# Altium project Control Panel v3.PrjPcb
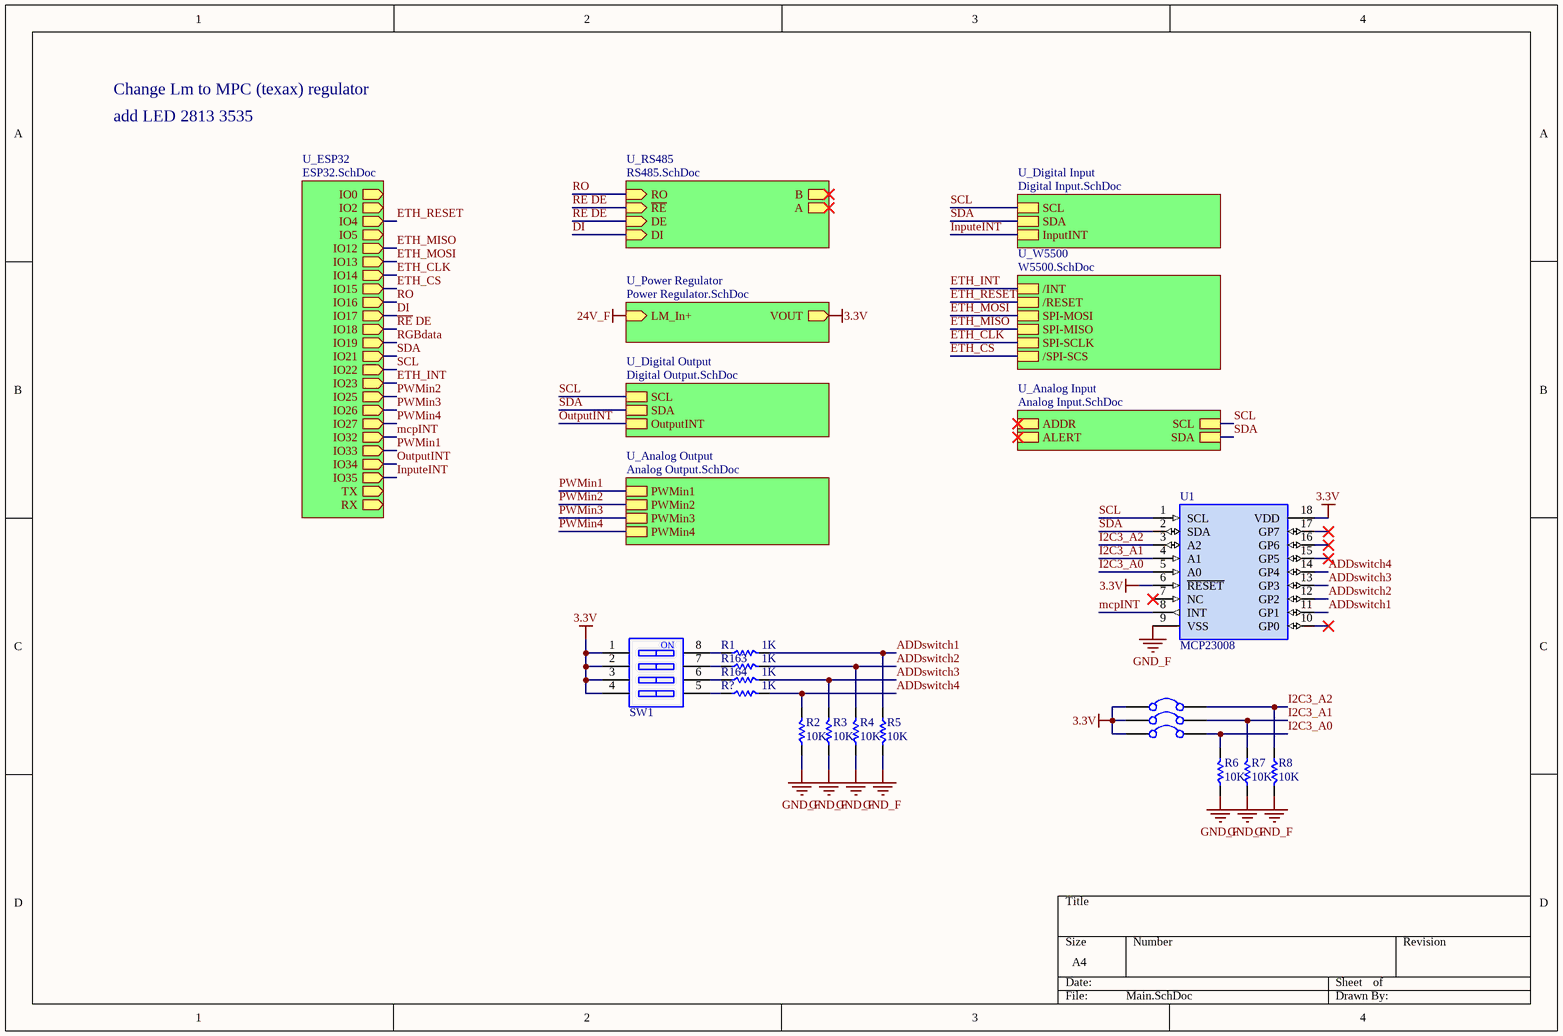
[diagram p0: Main.SchDoc]
6 sheets, 274 parts. Net scope: hierarchical (ports join the sheet entries above them; power ports are global).
Board file: Control Panel PCB v3.PcbDoc
Sheets:
  Main.SchDoc
    U_ESP32 = ESP32.SchDoc
    U_Power Regulator = Power Regulator.SchDoc
    U_Digital Output = Digital Output.SchDoc
    U_Digital Input = Digital Input.SchDoc
    U_W5500 = W5500.SchDoc

## Sheet Main.SchDoc
size A4; SheetNumber: 1; SheetTotal: 9

### Parts
R1  1K  [R 0805]
R2  10K  [R 0805]
R3  10K  [R 0805]
R4  10K  [R 0805]
R5  10K  [R 0805]
R6  10K  [R 0805]
R7  10K  [R 0805]
R8  10K  [R 0805]
R163  1K  [R 0805]
R164  1K  [R 0805]
R?  1K  [R 0805]
SB1  Solder Bridge  [Solder Bridge Open]  (value not drawn)
SB2  Solder Bridge  [Solder Bridge Open]  (value not drawn)
SB3  Solder Bridge  [Solder Bridge Open]  (value not drawn)
SW1  CSW-4P  [CSW DIP-4P_G]  (value not drawn)
U1  MCP23008  [SOP18W_M]

### Sub-sheets
U_Analog Input = Analog Input.SchDoc (file not in this document): ADDR, ALERT, SCL, SDA
U_Analog Output = Analog Output.SchDoc (file not in this document): PWMin1, PWMin2, PWMin3, PWMin4
U_Digital Input = Digital Input.SchDoc: SCL, SDA, InputINT
U_Digital Output = Digital Output.SchDoc: SCL, SDA, OutputINT
U_ESP32 = ESP32.SchDoc: IO2 (out), IO4 (out), IO5 (out), IO12 (out), IO13 (out), IO14 (out), IO15 (out), IO16 (out), IO17 (out), IO18 (out), IO19 (out), IO21 (out), IO22 (out), IO23 (out), IO25 (out), IO26 (out), IO27 (out), IO32 (out), IO33 (out), IO34 (out), IO35 (out), IO0 (out), TX (out), RX (out)
U_Power Regulator = Power Regulator.SchDoc: LM_In+ (in), VOUT (out)
U_RS485 = RS485.SchDoc (file not in this document): RO (in), ~{RE} (in), DE (in), DI (in), B (out), A (out)
U_W5500 = W5500.SchDoc: /INT, /RESET, SPI-MOSI, SPI-MISO, SPI-SCLK, /SPI-SCS

### Nets
3.3V: SB1.1 SB2.1 SB3.1 SW1.1 SW1.2 SW1.3 SW1.4 U1.6(~{RESET}) U1.18(VDD) ; sheet U_Power Regulator/VOUT
GND_F: R2.1 R3.1 R4.1 R5.2 R6.1 R7.1 R8.2 U1.9(VSS)
ADDswitch1: R1.2 R5.1 U1.11(GP1)
ADDswitch2: R4.2 R163.2 U1.12(GP2)
ADDswitch3: R3.2 R164.2 U1.13(GP3)
ADDswitch4: R2.2 R?.2 U1.14(GP4)
DI: sheet U_ESP32/IO17, sheet U_RS485/DI
ETH_CLK: sheet U_ESP32/IO14, sheet U_W5500/SPI-SCLK
ETH_CS: sheet U_ESP32/IO15, sheet U_W5500//SPI-SCS  [project net /SPI-SCS]
ETH_INT: sheet U_ESP32/IO23, sheet U_W5500//INT  [project net /INT]
ETH_MISO: sheet U_ESP32/IO12, sheet U_W5500/SPI-MISO
ETH_MOSI: sheet U_ESP32/IO13, sheet U_W5500/SPI-MOSI
ETH_RESET: sheet U_ESP32/IO4, sheet U_W5500//RESET  [project net /RESET]
I2C3_A0: R6.2 SB3.2 U1.5(A0)
I2C3_A1: R7.2 SB2.2 U1.4(A1)
I2C3_A2: R8.1 SB1.2 U1.3(A2)
InputeINT: sheet U_ESP32/IO35, sheet U_Digital Input/InputINT
mcpINT: U1.8(INT) ; sheet U_ESP32/IO32
OutputINT: sheet U_ESP32/IO34, sheet U_Digital Output/OutputINT
PWMin1: sheet U_ESP32/IO33, sheet U_Analog Output/PWMin1
PWMin2: sheet U_ESP32/IO25, sheet U_Analog Output/PWMin2
PWMin3: sheet U_ESP32/IO26, sheet U_Analog Output/PWMin3
PWMin4: sheet U_ESP32/IO27, sheet U_Analog Output/PWMin4
~{RE} DE: sheet U_ESP32/IO18, sheet U_RS485/~{RE}, sheet U_RS485/DE
RO: sheet U_ESP32/IO16, sheet U_RS485/RO
SCL: U1.1(SCL) ; sheet U_ESP32/IO22, sheet U_Digital Output/SCL, sheet U_Digital Input/SCL, sheet U_Analog Input/SCL
SDA: U1.2(SDA) ; sheet U_ESP32/IO21, sheet U_Digital Output/SDA, sheet U_Digital Input/SDA, sheet U_Analog Input/SDA
NetR1_1: R1.1 SW1.8
NetR163_1: R163.1 SW1.7
NetR164_1: R164.1 SW1.6
NetR?_1: R?.1 SW1.5

Not connected (* = marked no-connect by the designer): U1 7(NC)* 10(GP0)* 15(GP5)* 16(GP6)* 17(GP7)*

### Notes on the sheet
- Change Lm to MPC (texax) regulator
- add LED 2813 3535
- (in symbol CSW-4P) NO

### Library data of the parts
R1-R8 R163 R164 R? = R: Chip resistor; 版权归属: 源创客; BOM名称: Chip resistor; 学习资源: www.ooocke.com
SW1 = CSW-4P: 4-way code switch; BOM名称: 4路编码开关; 版权归属: 源创客; 学习资源: www.ooocke.com
U1 = MCP23008: 8 Bit I/O Expander

## Sheet ESP32.SchDoc
size A4; SheetNumber: 6; SheetTotal: 11
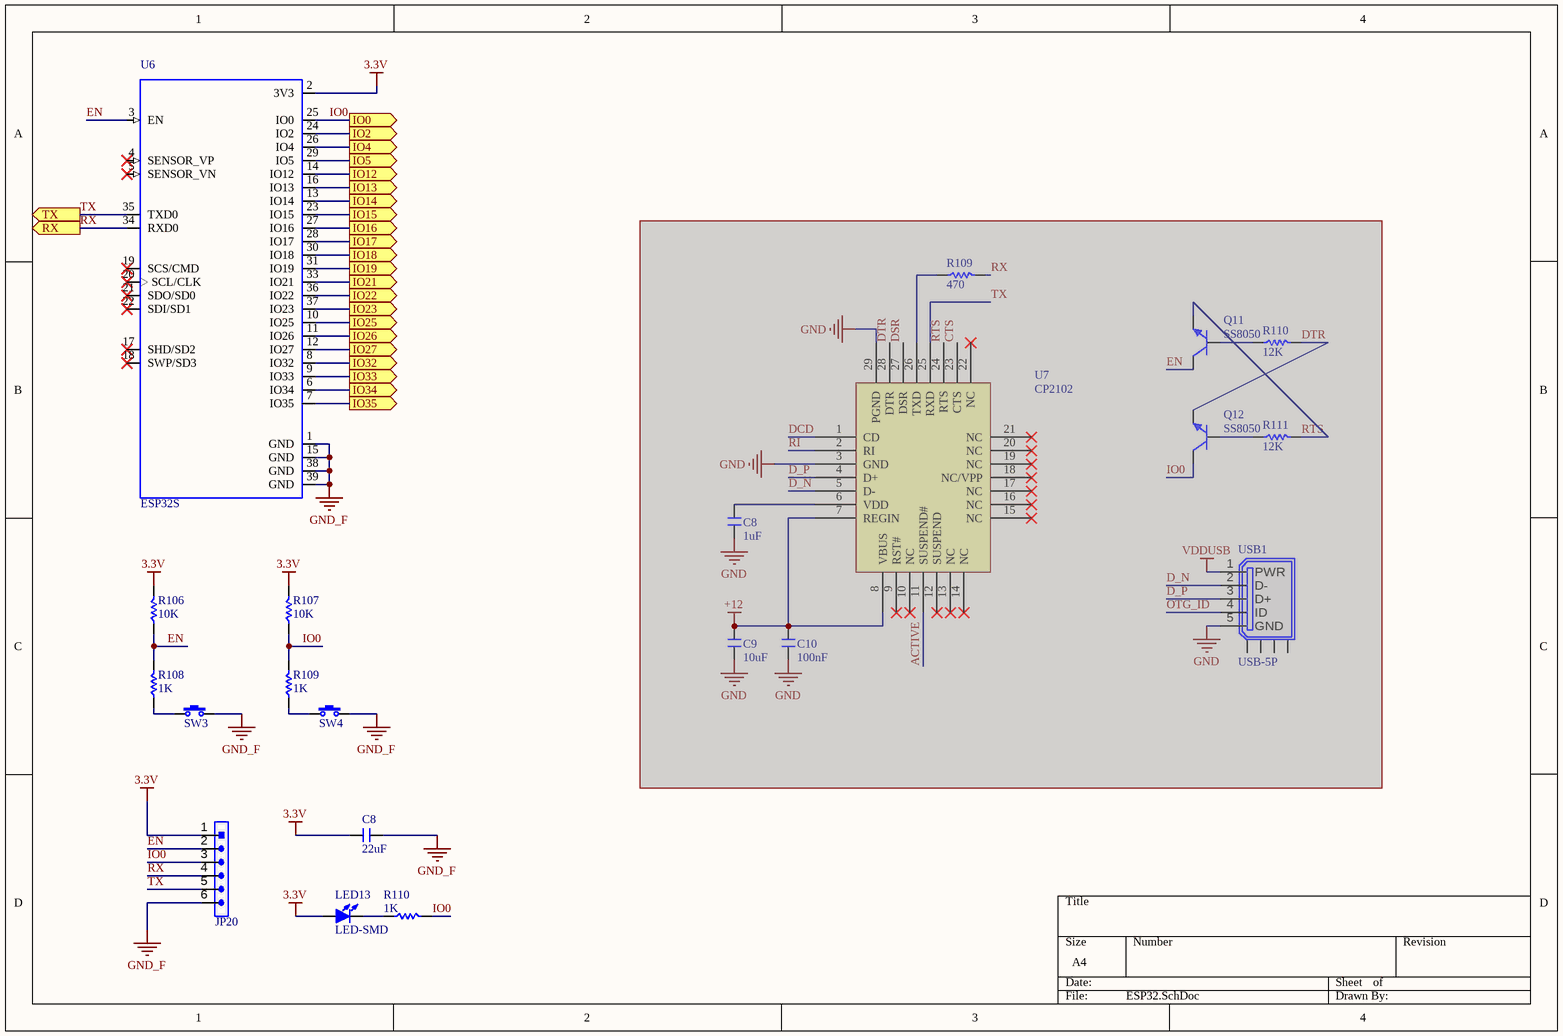
[diagram p1: ESP32.SchDoc]

### Parts
(Parts that share a designator on the sheet are numbered #1, #2 ... from top to bottom, then left to right.)
C8#1  1uF  [C 0805]  (masked out: inside a compile mask, not in the netlist)
C8#2  22uF  [C 0805]
C9#1  10uF  [C 0805]  (masked out: inside a compile mask, not in the netlist)
C10#1  100nF  [C 0805]  (masked out: inside a compile mask, not in the netlist)
JP20#1  HDR-1X6  [HDR-1X6]  (value not drawn)
LED13  LED-SMD  [LED 0805B]
Q11  SS8050  [SOT23-3N]  (masked out: inside a compile mask, not in the netlist)
Q12  SS8050  [SOT23-3N]  (masked out: inside a compile mask, not in the netlist)
R106  10K  [R 0805]
R107  10K  [R 0805]
R108  1K  [R 0805]
R109#1  470  [R 0805]  (masked out: inside a compile mask, not in the netlist)
R109#2  1K  [R 0805]
R110#1  12K  [R 0805]  (masked out: inside a compile mask, not in the netlist)
R110#2  1K  [R 0805]
R111#1  12K  [R 0805]  (masked out: inside a compile mask, not in the netlist)
SW3  3x6x5  [TSW SMD-3*6*2.5]  (value not drawn)
SW4  3x6x5  [TSW SMD-3*6*2.5]  (value not drawn)
U6  ESP32S  [ESP32S]
U7#1  CP2102  [QFN28]  (masked out: inside a compile mask, not in the netlist)
USB1  USB-5P  [USB-micro_B]  (masked out: inside a compile mask, not in the netlist)

### Ports
IO0 (out), IO2 (out), IO4 (out), IO5 (out), IO12 (out), IO13 (out), IO14 (out), IO15 (out), IO16 (out), IO17 (out), IO18 (out), IO19 (out), IO21 (out), IO22 (out), IO23 (out), IO25 (out), IO26 (out), IO27 (out), IO32 (out), IO33 (out), IO34 (out), IO35 (out), RX (out), TX (out)

### Nets
3.3V: C8#2.1 JP20#1.1 LED13.1(A) R106.2 R107.2 U6.2(3V3)
GND_F: C8#2.2 JP20#1.6 SW3.2 SW4.2 U6.1(GND) U6.15(GND) U6.38(GND) U6.39(GND)
/INT: U6.37(IO23) ; port IO23
/RESET: U6.26(IO4) ; port IO4
/SPI-SCS: U6.23(IO15) ; port IO15
DI: U6.28(IO17) ; port IO17
EN: JP20#1.2 R106.1 R108.2 U6.3(EN)
ETH_CLK: U6.13(IO14) ; port IO14
ETH_MISO: U6.14(IO12) ; port IO12
ETH_MOSI: U6.16(IO13) ; port IO13
InputeINT: U6.7(IO35) ; port IO35
IO0: JP20#1.3 R107.1 R109#2.2 R110#2.2 U6.25(IO0) ; port IO0
mcpINT: U6.8(IO32) ; port IO32
OutputINT: U6.6(IO34) ; port IO34
PWMin1: U6.9(IO33) ; port IO33
PWMin2: U6.10(IO25) ; port IO25
PWMin3: U6.11(IO26) ; port IO26
PWMin4: U6.12(IO27) ; port IO27
~{RE} DE: U6.30(IO18) ; port IO18
RGBdata: U6.31(IO19) ; port IO19
RO: U6.27(IO16) ; port IO16
RX: JP20#1.4 U6.34(RXD0) ; port RX
SCL: U6.36(IO22) ; port IO22
SDA: U6.33(IO21) ; port IO21
TX: JP20#1.5 U6.35(TXD0) ; port TX
NetLED13_2: LED13.2(K) R110#2.1
NetR108_1: R108.1 SW3.1
NetR109#2_1: R109#2.1 SW4.1
NetU6_24: U6.24(IO2) ; port IO2
NetU6_29: U6.29(IO5) ; port IO5

Not connected (* = marked no-connect by the designer): U6 4(SENSOR_VP)* 5(SENSOR_VN)* 17(SHD/SD2)* 18(SWP/SD3)* 19(SCS/CMD)* 20(SCL/CLK)* 21(SDO/SD0)* 22(SDI/SD1)*

### Library data of the parts
C8#1 C8#2 C9#1 C10#1 = C: Non-polar patch capacitor; BOM名称: 无极性贴片电容; 版权归属: 源创客; 学习资源: www.ooocke.com
JP20#1 = Header 6: 6P Connector; BOM名称: 6P接插件; 版权归属: 源创客; 学习资源: www.ooocke.com
LED13 = LED-SMD: Patch LED; BOM名称: 贴片LED; 版权归属: 源创客; 学习资源: www.ooocke.com
Q11 Q12 = 8050-SMD: High frequency amplification-NPN; BOM名称: 高频放大-NPN型; 版权归属: 源创客; 属性: 40V 1.5A 1W 100MHZ; 学习资源: www.ooocke.com
R106-R108 R109#1 R109#2 R110#1 R110#2 R111#1 = R: Chip resistor; 版权归属: 源创客; BOM名称: Chip resistor; 学习资源: www.ooocke.com
SW3 SW4 = TSW 3x6: 3x6 tact switch; BOM名称: 3x6轻触开关; 版权归属: 源创客; 学习资源: www.ooocke.com
U6 = ESP32S: MP: ESP32-WROOM-32D; MF: Espressif Systems; Package: Module Espressif Systems; Price: None; Availability: Unavailable; SnapEDA_Link: https://www.snapeda.com/parts/ESP32-WROOM-32D/Espressif%20Systems/view-part/?ref=snap; Value: *
U7#1 = CP2102: USB to USRT converter
USB1 = USB-5P: Micro & Mini USB female; BOM名称: 微型USB母座; 版权归属: 源创客; 学习资源: www.ooocke.com

## Sheet Power Regulator.SchDoc
size A4; SheetNumber: 2; SheetTotal: 9
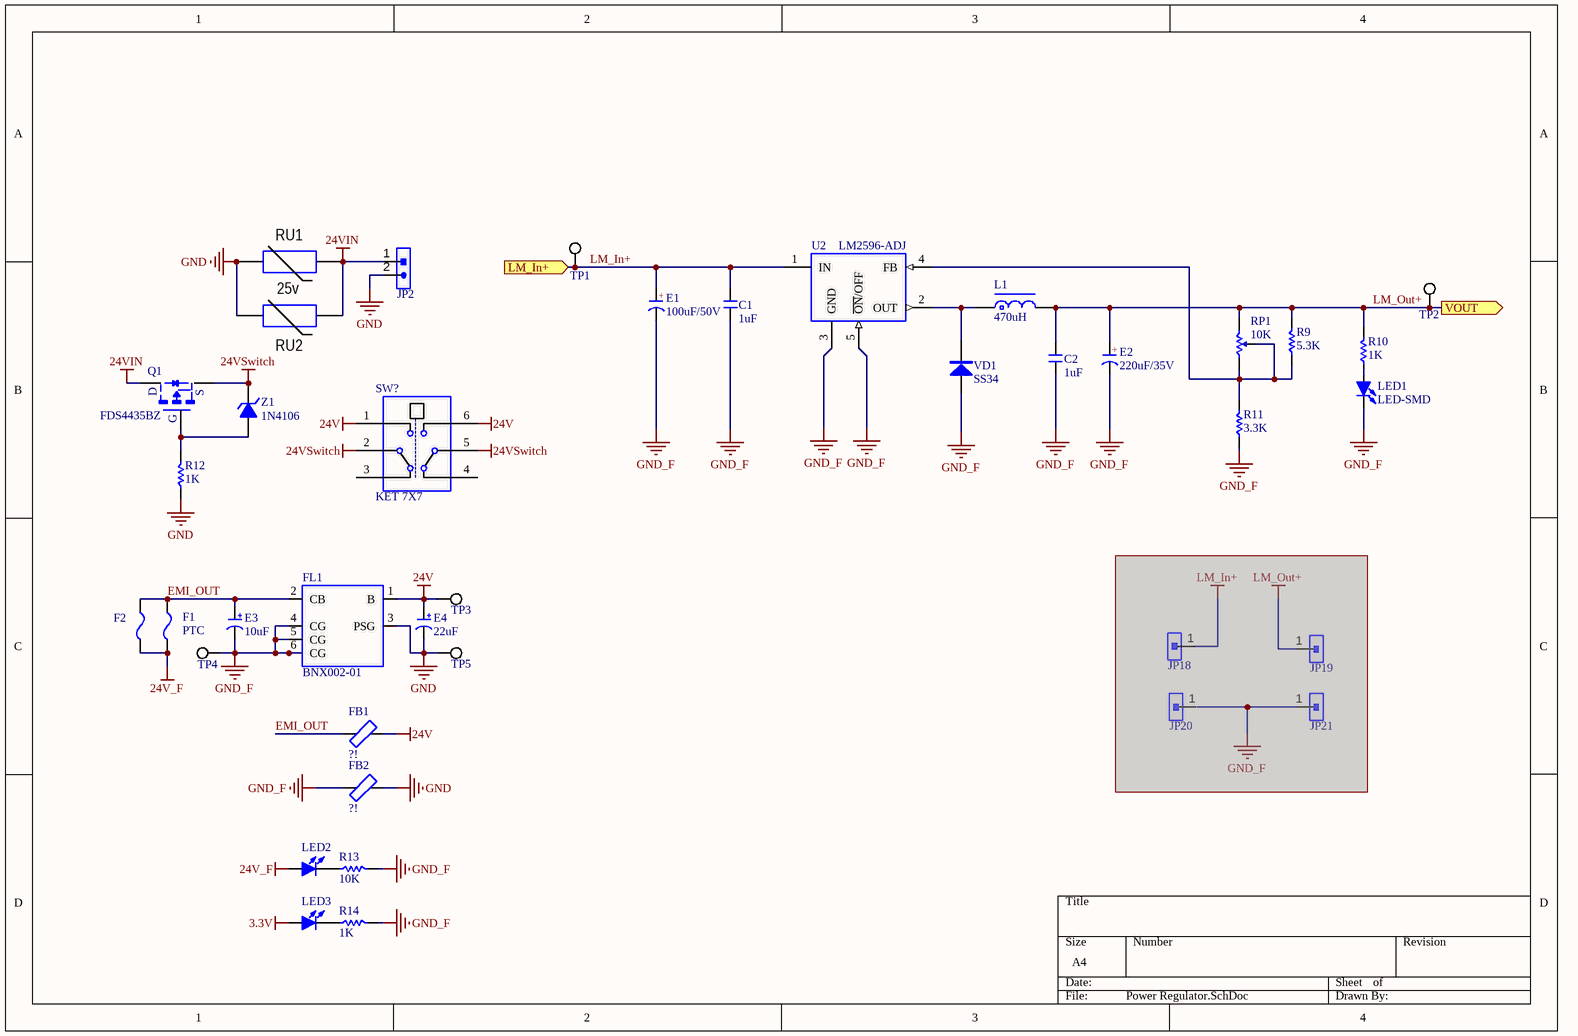
[diagram p2: Power Regulator.SchDoc]

### Parts
(Parts that share a designator on the sheet are numbered #1, #2 ... from top to bottom, then left to right.)
C1  1uF  [C 0805]
C2  1uF  [C 0805]
E1  100uF/50V  [CM E(8*10.2)]
E2  220uF/35V  [CM E(8*10.2)]
E3  10uF  [CM D(6.3*7.7)]
E4  22uF  [CM D(6.3*7.7)]
F1  PTC  [PTC]
F2  MSMD200-8V 2A  [FU 1206]  (value not drawn)
FB1  ?!  [F 1206]
FB2  ?!  [F 1206]
FL1  BNX002-01  [FIL_BNX002-01]
JP2  HDR-1X2  [KF2EDGK-2P_H_7.62]  (value not drawn)
JP18#1  HDR-1X1  [HDR-1X1]  (value not drawn)  (masked out: inside a compile mask, not in the netlist)
JP19  HDR-1X1  [HDR-1X1]  (value not drawn)  (masked out: inside a compile mask, not in the netlist)
JP20#2  HDR-1X1  [HDR-1X1]  (value not drawn)  (masked out: inside a compile mask, not in the netlist)
JP21  HDR-1X1  [HDR-1X1]  (value not drawn)  (masked out: inside a compile mask, not in the netlist)
L1  470uH  [CDRH127]
LED1  LED-SMD  [LED 0805R]
LED2  LED-SMD  [LED 0805R]  (value not drawn)
LED3  LED-SMD  [LED 0805R]  (value not drawn)
Q1  FDS4435BZ  [SOP8-E3]
R9  5.3K  [R 0805]
R10  1K  [R 0805]
R11  3.3K  [R 0805]
R12  1K  [R 0805]
R13  10K  [R 0805]
R14  1K  [R 0805]
RP1  10K  [3296W]
RU1  25v  [SMA]
RU2  *  [Varistor Short Hieght - Straight]  (value not drawn)
SW?  KET 7X7  [KFT DIP-7X7]
TP1  Test Point Pad  [TP15]  (value not drawn)
TP2  Test Point Pad  [TP15]  (value not drawn)
TP3  Test Point Pad  [TP15]  (value not drawn)
TP4  Test Point Pad  [TP15]  (value not drawn)
TP5  Test Point Pad  [TP15]  (value not drawn)
U2  LM2596-ADJ  [TO263-5A]
VD1  SS34  [SMA]
Z1  1N4106  [DO-213AA]

### Ports
LM_In+ (in), VOUT (out)

### Nets
3.3V: C2.2 E2.1(A) L1.2 LED3.1(A) R9.2 R10.2 RP1.2 TP2.1 ; port VOUT  [also labelled LM_Out+]
24V: E4.1(A) FB1.2 FL1.1(B) SW?.1 SW?.6 TP3.1
24VIN: JP2.1 Q1.5-8(D) RU1.2 RU2.2
24VSwitch: Q1.1-3(S) SW?.2 SW?.5 Z1.2(K)
GND: E4.2(K) FB2.2 FL1.3(PSG) JP2.2 R12.1 RU1.1 RU2.1 TP5.1
GND_F: C1.1 C2.1 E1.2(K) E2.2(K) E3.2(K) FB2.1 FL1.4(CG) FL1.5(CG) FL1.6(CG) LED1.2(K) R11.1 R13.2 R14.2 TP4.1 U2.3(GND) U2.5(~{ON}/OFF) VD1.1(A)
LM_In+: C1.2 E1.1(A) F1.1 F2.1 LED2.1(A) TP1.1 U2.1(IN) ; port LM_In+  [also labelled 24V_F]
EMI_OUT: E3.1(A) F1.2 F2.2 FB1.1 FL1.2(CB)
NetL1_1: L1.1 U2.2(OUT) VD1.2(K)
NetLED1_1: LED1.1(A) R10.1
NetLED2_2: LED2.2(K) R13.1
NetLED3_2: LED3.2(K) R14.1
NetQ1_4: Q1.4(G) R12.2 Z1.1(A)
NetR9_1: R9.1 R11.2 RP1.1 RP1.ADJ U2.4(FB)

Not connected (* = marked no-connect by the designer): SW? 3 4

### Notes on the sheet
- (in symbol C-CM) +
- (in symbol KET 7X7) ---------------

### Library data of the parts
C1 C2 = C: as C8#1 on sheet ESP32; 学习资源: www.ooocke.com
E1-E4 = C-CM: Chip electrolytic capacitor; BOM名称: 贴片电解电容; 版权归属: 源创客; 学习资源: www.ooocke.com
F2 = FU: Chip fuse; BOM名称: 贴片保险丝; 版权归属: 源创客; 学习资源: www.ooocke.com
FB1 FB2 = FB: Ferrite Bead; BOM名称: 贴片电阻; 版权归属: 源创客; 学习资源: www.ooocke.com
FL1 = BNX002-01: LC EMI Filter 5th Order Low Pass 2 Channel 10A Block, 4 Lead; MF: Murata; Package: Block-4 Murata; Price: None; SnapEDA_Link: https://www.snapeda.com/parts/BNX002-01/Murata%20Electronics%20North%20America/view-part/12269/?ref=snap; Availability: Unavailable; Value: *; MP: BNX002-01
JP2 = Header 2: 2P Connector; BOM名称: 2P接插件; 版权归属: 源创客; 学习资源: www.ooocke.com
JP18#1 JP19 JP20#2 JP21 = Header 1: 1P Connector; BOM名称: 1P接插件; 版权归属: 源创客; 学习资源: www.ooocke.com
L1 = L-CDRH: Power shielded inductor; BOM名称: 功率屏蔽电感; 版权归属: 源创客; 学习资源: www.ooocke.com
LED1-LED3 = LED-SMD: Patch LED; BOM名称: 贴片LED; 版权归属: 源创客; 学习资源: www.ooocke.com
R9-R14 = R: Chip resistor; 版权归属: 源创客; BOM名称: Chip resistor; 学习资源: www.ooocke.com
RP1 = RP-THD: Plug-in potentiometer; BOM名称: 插件电位器; 版权归属: 源创客; 学习资源: www.ooocke.com
RU1 RU2 = V: Versiror; Manufacturer: *; Model: *; HelpURL: *; ComponentKind: *; Value: *
SW? = KET 7X7: 7*7 switch; BOM名称: 7*7开关; 版权归属: 源创客; 学习资源: www.ooocke.com
TP1-TP5 = Test Point Pad: Company: SJ Libraries; Designer: Eng. Saeid Jorablo; Rule: UNIONINDEX=0|RULEKIND=ComponentClearance|NETSCOPE=AnyNet|LAYERKIND=SameLayer|NAME=Schematic Component Clearance Constraint|GAP=0mil|COLLISIONCHECKMODE=3|VERTICALGAP=0mil|SHOWDISTANCES=FALSE|UNIT=Imperial; Mounting Technology: Surface Mount\Through-Hole; ComponentLink1Description: Datasheet; Pin Count: 0; Update Date: 6/3/2012; Category: MISC; HelpURL: http://s3.picofile.com/file/7443264187/Coming_Soon_logo.gif
U2 = LM2596: DC step-down chip; BOM名称: DC稳压芯片; 版权归属: 源创客; 学习资源: www.ooocke.com
VD1 = SS34: Schottky diodes; BOM名称: 肖特基二极管; 版权归属: 源创客; 属性: 40V/3A; 学习资源: www.ooocke.com
Z1 = 1N4106: 12V/0.5W voltage regulator; BOM名称: 12V/0.5W稳压管; 版权归属: 源创客; 学习资源: www.ooocke.com

## Sheet Digital Output.SchDoc
size A4; SheetNumber: 4; SheetTotal: 11
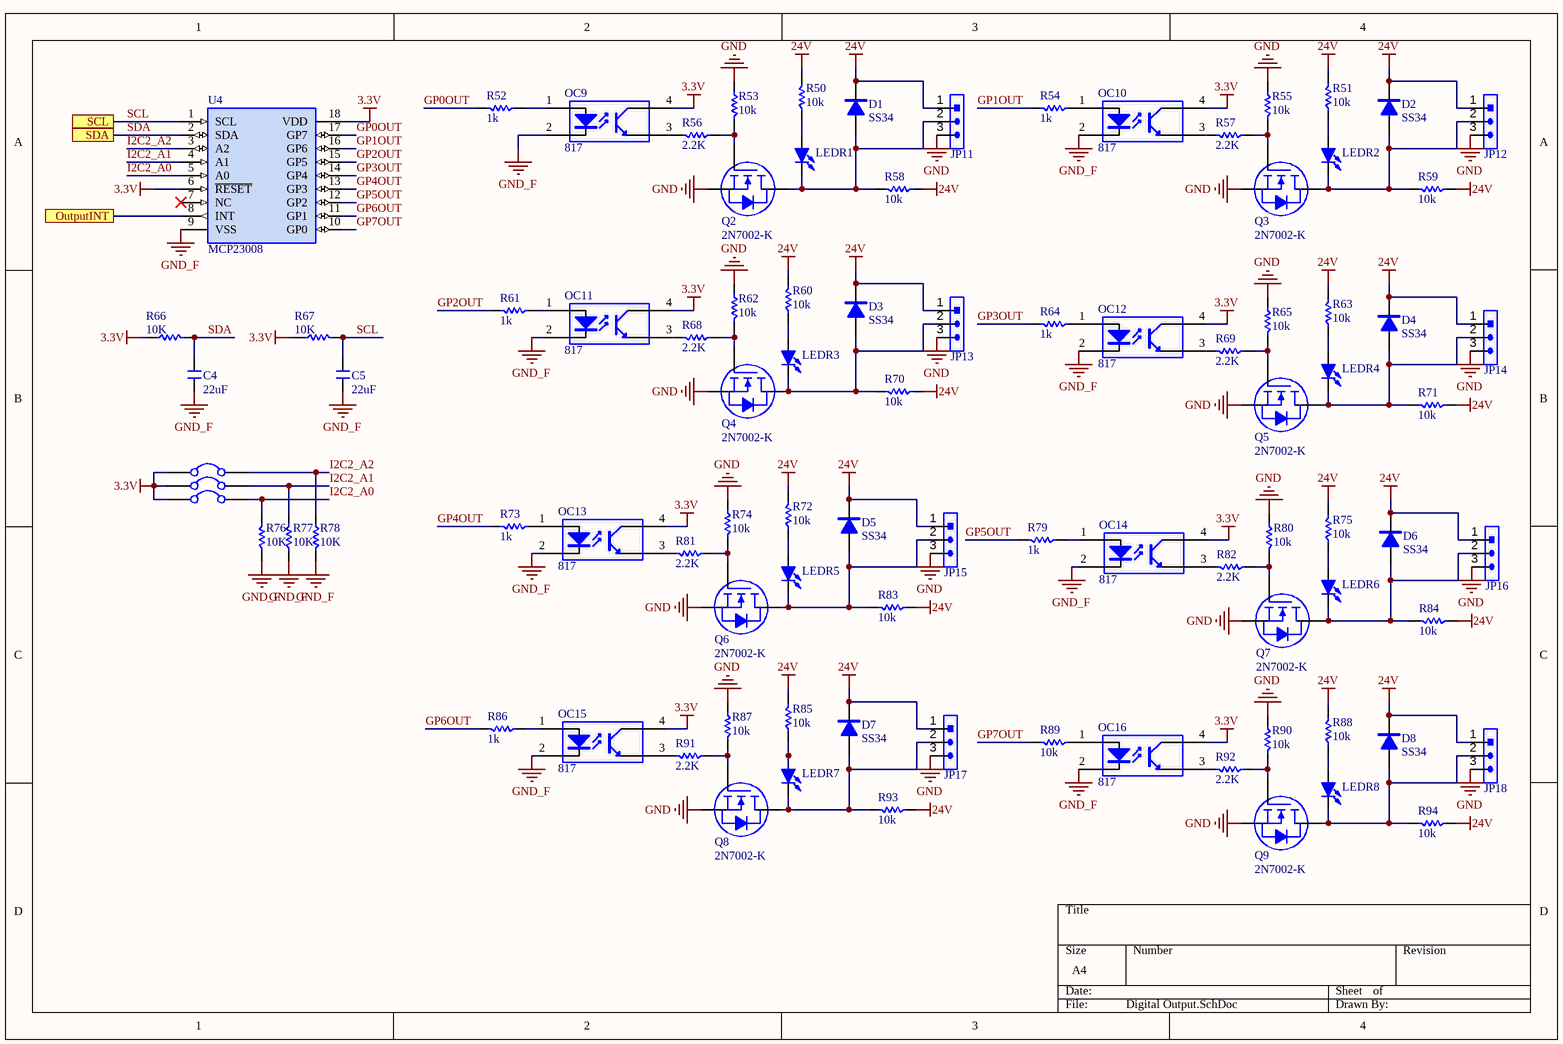
[diagram p3: Digital Output.SchDoc]

### Parts
(Parts that share a designator on the sheet are numbered #1, #2 ... from top to bottom, then left to right.)
C4#1  22uF  [C 0805]
C5  22uF  [C 0805]
D1  SS34  [SMA]
D2  SS34  [SMA]
D3  SS34  [SMA]
D4  SS34  [SMA]
D5  SS34  [SMA]
D6  SS34  [SMA]
D7  SS34  [SMA]
D8  SS34  [SMA]
JP11  HDR-1X3  [KF301-3P]  (value not drawn)
JP12  HDR-1X3  [KF301-3P]  (value not drawn)
JP13  HDR-1X3  [KF301-3P]  (value not drawn)
JP14  HDR-1X3  [KF301-3P]  (value not drawn)
JP15  HDR-1X3  [KF301-3P]  (value not drawn)
JP16  HDR-1X3  [KF301-3P]  (value not drawn)
JP17  HDR-1X3  [KF301-3P]  (value not drawn)
JP18#2  HDR-1X3  [KF301-3P]  (value not drawn)
LEDR1  LED-SMD  [LED 0805B]  (value not drawn)
LEDR2  LED-SMD  [LED 0805B]  (value not drawn)
LEDR3  LED-SMD  [LED 0805B]  (value not drawn)
LEDR4  LED-SMD  [LED 0805B]  (value not drawn)
LEDR5  LED-SMD  [LED 0805B]  (value not drawn)
LEDR6  LED-SMD  [LED 0805B]  (value not drawn)
LEDR7  LED-SMD  [LED 0805B]  (value not drawn)
LEDR8  LED-SMD  [LED 0805B]  (value not drawn)
OC9  817  [PC817-SMD]
OC10  817  [PC817-SMD]
OC11  817  [PC817-SMD]
OC12  817  [PC817-SMD]
OC13  817  [PC817-SMD]
OC14  817  [PC817-SMD]
OC15  817  [PC817-SMD]
OC16  817  [PC817-SMD]
Q2  2N7002-K  [SOT23-3L]
Q3  2N7002-K  [SOT23-3L]
Q4  2N7002-K  [SOT23-3L]
Q5  2N7002-K  [SOT23-3L]
Q6  2N7002-K  [SOT23-3L]
Q7  2N7002-K  [SOT23-3L]
Q8  2N7002-K  [SOT23-3L]
Q9  2N7002-K  [SOT23-3L]
R50  10k  [R 0805]
R51  10k  [R 0805]
R52  1k  [R 0805]
R53  10k  [R 0805]
R54  1k  [R 0805]
R55  10k  [R 0805]
R56  2.2K  [R 0805]
R57  2.2K  [R 0805]
R58  10k  [R 0805]
R59  10k  [R 0805]
R60  10k  [R 0805]
R61  1k  [R 0805]
R62  10k  [R 0805]
R63  10k  [R 0805]
R64  1k  [R 0805]
R65  10k  [R 0805]
R66  10K  [R 0805]
R67  10K  [R 0805]
R68  2.2K  [R 0805]
R69  2.2K  [R 0805]
R70  10k  [R 0805]
R71  10k  [R 0805]
R72  10k  [R 0805]
R73  1k  [R 0805]
R74  10k  [R 0805]
R75  10k  [R 0805]
R76  10K  [R 0805]
R77  10K  [R 0805]
R78  10K  [R 0805]
R79  1k  [R 0805]
R80  10k  [R 0805]
R81  2.2K  [R 0805]
R82  2.2K  [R 0805]
R83  10k  [R 0805]
R84  10k  [R 0805]
R85  10k  [R 0805]
R86  1k  [R 0805]
R87  10k  [R 0805]
R88  10k  [R 0805]
R89  10k  [R 0805]
R90  10k  [R 0805]
R91  2.2K  [R 0805]
R92  2.2K  [R 0805]
R93  10k  [R 0805]
R94  10k  [R 0805]
SB7  Solder Bridge  [Solder Bridge Open]  (value not drawn)
SB8  Solder Bridge  [Solder Bridge Open]  (value not drawn)
SB9  Solder Bridge  [Solder Bridge Open]  (value not drawn)
U4  MCP23008  [SOP18W_M]

### Ports
OutputINT, SCL, SDA

### Nets
3.3V: OC9.4(C) OC10.4(C) OC11.4(C) OC12.4(C) OC13.4(C) OC14.4(C) OC15.4(C) OC16.4(C) R66.1 R67.1 SB7.1 SB8.1 SB9.1 U4.6(~{RESET}) U4.18(VDD)
24V: D1.2(K) D2.2(K) D3.2(K) D4.2(K) D5.2(K) D6.2(K) D7.2(K) D8.2(K) JP11.1 JP12.1 JP13.1 JP14.1 JP15.1 JP16.1 JP17.1 JP18#2.1 R50.2 R51.2 R58.1 R59.1 R60.2 R63.2 R70.1 R71.1 R72.2 R75.2 R83.1 R84.1 R85.2 R88.2 R93.1 R94.1
GND: JP11.3 JP12.3 JP13.3 JP14.3 JP15.3 JP16.3 JP17.3 JP18#2.3 Q2.2(S) Q3.2(S) Q4.2(S) Q5.2(S) Q6.2(S) Q7.2(S) Q8.2(S) Q9.2(S) R53.1 R55.1 R62.1 R65.1 R74.1 R80.1 R87.1 R90.1
GND_F: C4#1.1 C5.1 OC9.2(K) OC10.2(K) OC11.2(K) OC12.2(K) OC13.2(K) OC14.2(K) OC15.2(K) OC16.2(K) R76.1 R77.1 R78.2 U4.9(VSS)
GP0OUT: R52.2 U4.17(GP7)
GP1OUT: R54.2 U4.16(GP6)
GP2OUT: R61.2 U4.15(GP5)
GP3OUT: R64.2 U4.14(GP4)
GP4OUT: R73.2 U4.13(GP3)
GP5OUT: R79.2 U4.12(GP2)
GP6OUT: R86.2 U4.11(GP1)
GP7OUT: R89.2 U4.10(GP0)
I2C2_A0: R76.2 SB9.2 U4.5(A0)
I2C2_A1: R77.2 SB8.2 U4.4(A1)
I2C2_A2: R78.1 SB7.2 U4.3(A2)
OutputINT: U4.8(INT) ; port OutputINT
SCL: C5.2 R67.2 U4.1(SCL) ; port SCL
SDA: C4#1.2 R66.2 U4.2(SDA) ; port SDA
NetD1_1: D1.1(A) JP11.2 LEDR1.2(K) Q2.3(D) R58.2
NetD2_1: D2.1(A) JP12.2 LEDR2.2(K) Q3.3(D) R59.2
NetD3_1: D3.1(A) JP13.2 LEDR3.2(K) Q4.3(D) R70.2
NetD4_1: D4.1(A) JP14.2 LEDR4.2(K) Q5.3(D) R71.2
NetD5_1: D5.1(A) JP15.2 LEDR5.2(K) Q6.3(D) R83.2
NetD6_1: D6.1(A) JP16.2 LEDR6.2(K) Q7.3(D) R84.2
NetD7_1: D7.1(A) JP17.2 LEDR7.2(K) Q8.3(D) R93.2
NetD8_1: D8.1(A) JP18#2.2 LEDR8.2(K) Q9.3(D) R94.2
NetLEDR1_1: LEDR1.1(A) R50.1
NetLEDR2_1: LEDR2.1(A) R51.1
NetLEDR3_1: LEDR3.1(A) R60.1
NetLEDR4_1: LEDR4.1(A) R63.1
NetLEDR5_1: LEDR5.1(A) R72.1
NetLEDR6_1: LEDR6.1(A) R75.1
NetLEDR7_1: LEDR7.1(A) R85.1
NetLEDR8_1: LEDR8.1(A) R88.1
NetOC9_1: OC9.1(A) R52.1
NetOC9_3: OC9.3(E) R56.2
NetOC10_1: OC10.1(A) R54.1
NetOC10_3: OC10.3(E) R57.2
NetOC11_1: OC11.1(A) R61.1
NetOC11_3: OC11.3(E) R68.2
NetOC12_1: OC12.1(A) R64.1
NetOC12_3: OC12.3(E) R69.2
NetOC13_1: OC13.1(A) R73.1
NetOC13_3: OC13.3(E) R81.2
NetOC14_1: OC14.1(A) R79.1
NetOC14_3: OC14.3(E) R82.2
NetOC15_1: OC15.1(A) R86.1
NetOC15_3: OC15.3(E) R91.2
NetOC16_1: OC16.1(A) R89.1
NetOC16_3: OC16.3(E) R92.2
NetQ2_1: Q2.1(G) R53.2 R56.1
NetQ3_1: Q3.1(G) R55.2 R57.1
NetQ4_1: Q4.1(G) R62.2 R68.1
NetQ5_1: Q5.1(G) R65.2 R69.1
NetQ6_1: Q6.1(G) R74.2 R81.1
NetQ7_1: Q7.1(G) R80.2 R82.1
NetQ8_1: Q8.1(G) R87.2 R91.1
NetQ9_1: Q9.1(G) R90.2 R92.1

Not connected (* = marked no-connect by the designer): U4 7(NC)*

### Library data of the parts
C4#1 C5 = C: as C8#1 on sheet ESP32; 学习资源: www.ooocke.com
D1-D8 = M7: Rectifier diode; BOM名称: 整流二极管; 版权归属: 源创客; 学习资源: www.ooocke.com
JP11-JP17 JP18#2 = Header 3: 3P Connector; BOM名称: 3P接插件; 版权归属: 源创客; 学习资源: www.ooocke.com
LEDR1-LEDR8 = LED-SMD: Patch LED; BOM名称: 贴片LED; 版权归属: 源创客; 学习资源: www.ooocke.com
OC9-OC16 = 817: AC Input Photocoupler; BOM名称: 线性光耦; 版权归属: 源创客; 学习资源: www.ooocke.com
Q2-Q9 = 2N7002-SMD: N-Channel Enhancement Mode Field Effect Transistor
R50-R94 = R: Chip resistor; 版权归属: 源创客; BOM名称: Chip resistor; 学习资源: www.ooocke.com
U4 = MCP23008: 8 Bit I/O Expander

## Sheet Digital Input.SchDoc
size A4; SheetNumber: 3; SheetTotal: 11
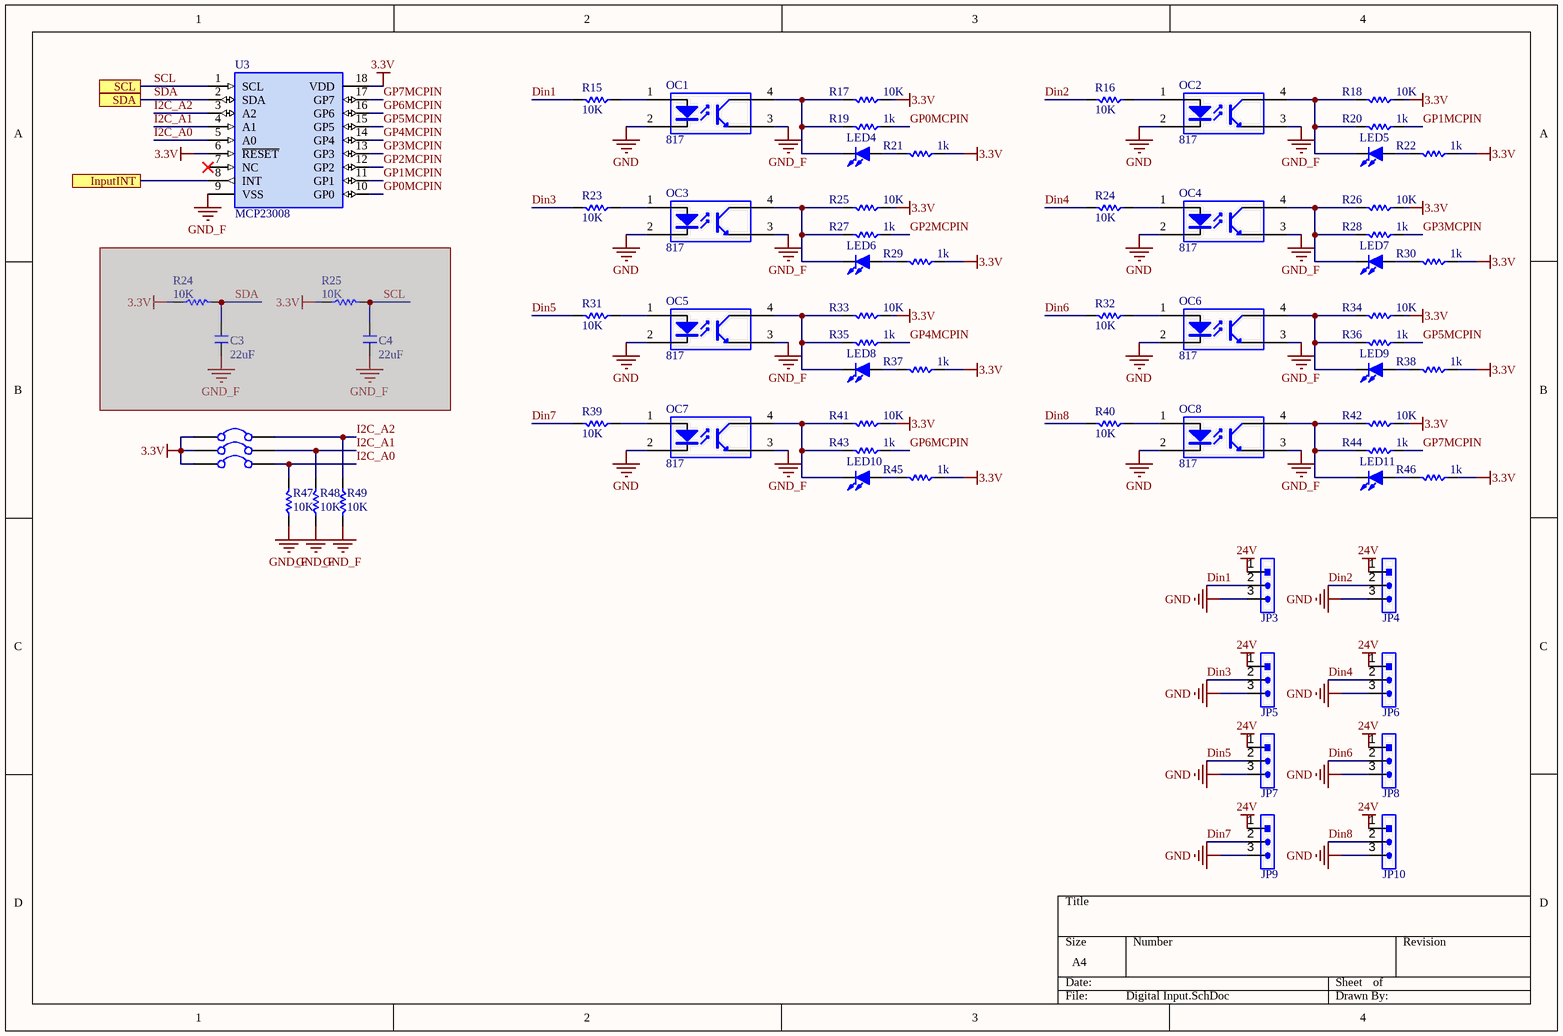
[diagram p4: Digital Input.SchDoc]

### Parts
(Parts that share a designator on the sheet are numbered #1, #2 ... from top to bottom, then left to right.)
C3#1  22uF  [C 0805]  (masked out: inside a compile mask, not in the netlist)
C4#2  22uF  [C 0805]  (masked out: inside a compile mask, not in the netlist)
JP3  HDR-1X3  [KF301-3P]  (value not drawn)
JP4  HDR-1X3  [KF301-3P]  (value not drawn)
JP5  HDR-1X3  [KF301-3P]  (value not drawn)
JP6  HDR-1X3  [KF301-3P]  (value not drawn)
JP7  HDR-1X3  [KF301-3P]  (value not drawn)
JP8  HDR-1X3  [KF301-3P]  (value not drawn)
JP9  HDR-1X3  [KF301-3P]  (value not drawn)
JP10  HDR-1X3  [KF301-3P]  (value not drawn)
LED4  LED-SMD  [LED 0805B]  (value not drawn)
LED5  LED-SMD  [LED 0805B]  (value not drawn)
LED6  LED-SMD  [LED 0805B]  (value not drawn)
LED7  LED-SMD  [LED 0805B]  (value not drawn)
LED8  LED-SMD  [LED 0805B]  (value not drawn)
LED9  LED-SMD  [LED 0805B]  (value not drawn)
LED10  LED-SMD  [LED 0805B]  (value not drawn)
LED11  LED-SMD  [LED 0805B]  (value not drawn)
OC1  817  [PC817-SMD]
OC2  817  [PC817-SMD]
OC3  817  [PC817-SMD]
OC4  817  [PC817-SMD]
OC5  817  [PC817-SMD]
OC6  817  [PC817-SMD]
OC7  817  [PC817-SMD]
OC8  817  [PC817-SMD]
R15  10K  [R 0805]
R16  10K  [R 0805]
R17  10K  [R 0805]
R18  10K  [R 0805]
R19  1k  [R 0805]
R20  1k  [R 0805]
R21  1k  [R 0805]
R22  1k  [R 0805]
R23  10K  [R 0805]
R24#1  10K  [R 0805]
R24#2  10K  [R 0805]  (masked out: inside a compile mask, not in the netlist)
R25#1  10K  [R 0805]
R25#2  10K  [R 0805]  (masked out: inside a compile mask, not in the netlist)
R26  10K  [R 0805]
R27  1k  [R 0805]
R28  1k  [R 0805]
R29  1k  [R 0805]
R30  1k  [R 0805]
R31  10K  [R 0805]
R32  10K  [R 0805]
R33  10K  [R 0805]
R34  10K  [R 0805]
R35  1k  [R 0805]
R36  1k  [R 0805]
R37  1k  [R 0805]
R38  1k  [R 0805]
R39  10K  [R 0805]
R40  10K  [R 0805]
R41  10K  [R 0805]
R42  10K  [R 0805]
R43  1k  [R 0805]
R44  1k  [R 0805]
R45  1k  [R 0805]
R46  1k  [R 0805]
R47  10K  [R 0805]
R48  10K  [R 0805]
R49  10K  [R 0805]
SB4  Solder Bridge  [Solder Bridge Open]  (value not drawn)
SB5  Solder Bridge  [Solder Bridge Open]  (value not drawn)
SB6  Solder Bridge  [Solder Bridge Open]  (value not drawn)
U3  MCP23008  [SOP18W_M]

### Ports
InputINT, SCL, SDA

### Nets
3.3V: R17.1 R18.1 R21.1 R22.1 R25#1.1 R26.1 R29.1 R30.1 R33.1 R34.1 R37.1 R38.1 R41.1 R42.1 R45.1 R46.1 SB4.1 SB5.1 SB6.1 U3.6(~{RESET}) U3.18(VDD)
24V: JP3.1 JP4.1 JP5.1 JP6.1 JP7.1 JP8.1 JP9.1 JP10.1
GND: JP3.3 JP4.3 JP5.3 JP6.3 JP7.3 JP8.3 JP9.3 JP10.3 OC1.2(K) OC2.2(K) OC3.2(K) OC4.2(K) OC5.2(K) OC6.2(K) OC7.2(K) OC8.2(K)
GND_F: OC1.3(E) OC2.3(E) OC3.3(E) OC4.3(E) OC5.3(E) OC6.3(E) OC7.3(E) OC8.3(E) R47.1 R48.1 R49.2 U3.9(VSS)
Din1: JP3.2 R15.2
Din2: JP4.2 R16.2
Din3: JP5.2 R23.2
Din4: JP6.2 R24#1.2
Din5: JP7.2 R31.2
Din6: JP8.2 R32.2
Din7: JP9.2 R39.2
Din8: JP10.2 R40.2
GP0MCPIN: R19.1 U3.10(GP0)
GP1MCPIN: R20.1 U3.11(GP1)
GP2MCPIN: R27.1 U3.12(GP2)
GP3MCPIN: R28.1 U3.13(GP3)
GP4MCPIN: R35.1 U3.14(GP4)
GP5MCPIN: R36.1 U3.15(GP5)
GP6MCPIN: R43.1 U3.16(GP6)
GP7MCPIN: R44.1 U3.17(GP7)
I2C_A0: R47.2 SB6.2 U3.5(A0)
I2C_A1: R48.2 SB5.2 U3.4(A1)
I2C_A2: R49.1 SB4.2 U3.3(A2)
InputeINT: U3.8(INT) ; port InputINT
SCL: U3.1(SCL) ; port SCL
SDA: U3.2(SDA) ; port SDA
NetLED4_1: LED4.1(A) R21.2
NetLED4_2: LED4.2(K) OC1.4(C) R17.2 R19.2
NetLED5_1: LED5.1(A) R22.2
NetLED5_2: LED5.2(K) OC2.4(C) R18.2 R20.2
NetLED6_1: LED6.1(A) R29.2
NetLED6_2: LED6.2(K) OC3.4(C) R25#1.2 R27.2
NetLED7_1: LED7.1(A) R30.2
NetLED7_2: LED7.2(K) OC4.4(C) R26.2 R28.2
NetLED8_1: LED8.1(A) R37.2
NetLED8_2: LED8.2(K) OC5.4(C) R33.2 R35.2
NetLED9_1: LED9.1(A) R38.2
NetLED9_2: LED9.2(K) OC6.4(C) R34.2 R36.2
NetLED10_1: LED10.1(A) R45.2
NetLED10_2: LED10.2(K) OC7.4(C) R41.2 R43.2
NetLED11_1: LED11.1(A) R46.2
NetLED11_2: LED11.2(K) OC8.4(C) R42.2 R44.2
NetOC1_1: OC1.1(A) R15.1
NetOC2_1: OC2.1(A) R16.1
NetOC3_1: OC3.1(A) R23.1
NetOC4_1: OC4.1(A) R24#1.1
NetOC5_1: OC5.1(A) R31.1
NetOC6_1: OC6.1(A) R32.1
NetOC7_1: OC7.1(A) R39.1
NetOC8_1: OC8.1(A) R40.1

Not connected (* = marked no-connect by the designer): U3 7(NC)*

### Library data of the parts
C3#1 C4#2 = C: as C8#1 on sheet ESP32; 学习资源: www.ooocke.com
JP3-JP10 = Header 3: 3P Connector; BOM名称: 3P接插件; 版权归属: 源创客; 学习资源: www.ooocke.com
LED4-LED11 = LED-SMD: Patch LED; BOM名称: 贴片LED; 版权归属: 源创客; 学习资源: www.ooocke.com
OC1-OC8 = 817: as OC9 on sheet Digital Output; 学习资源: www.ooocke.com
R15-R23 R24#1 R24#2 R25#1 R25#2 R26-R49 = R: Chip resistor; 版权归属: 源创客; BOM名称: Chip resistor; 学习资源: www.ooocke.com
U3 = MCP23008: 8 Bit I/O Expander

## Sheet W5500.SchDoc
size A4; SheetNumber: 8; SheetTotal: 9
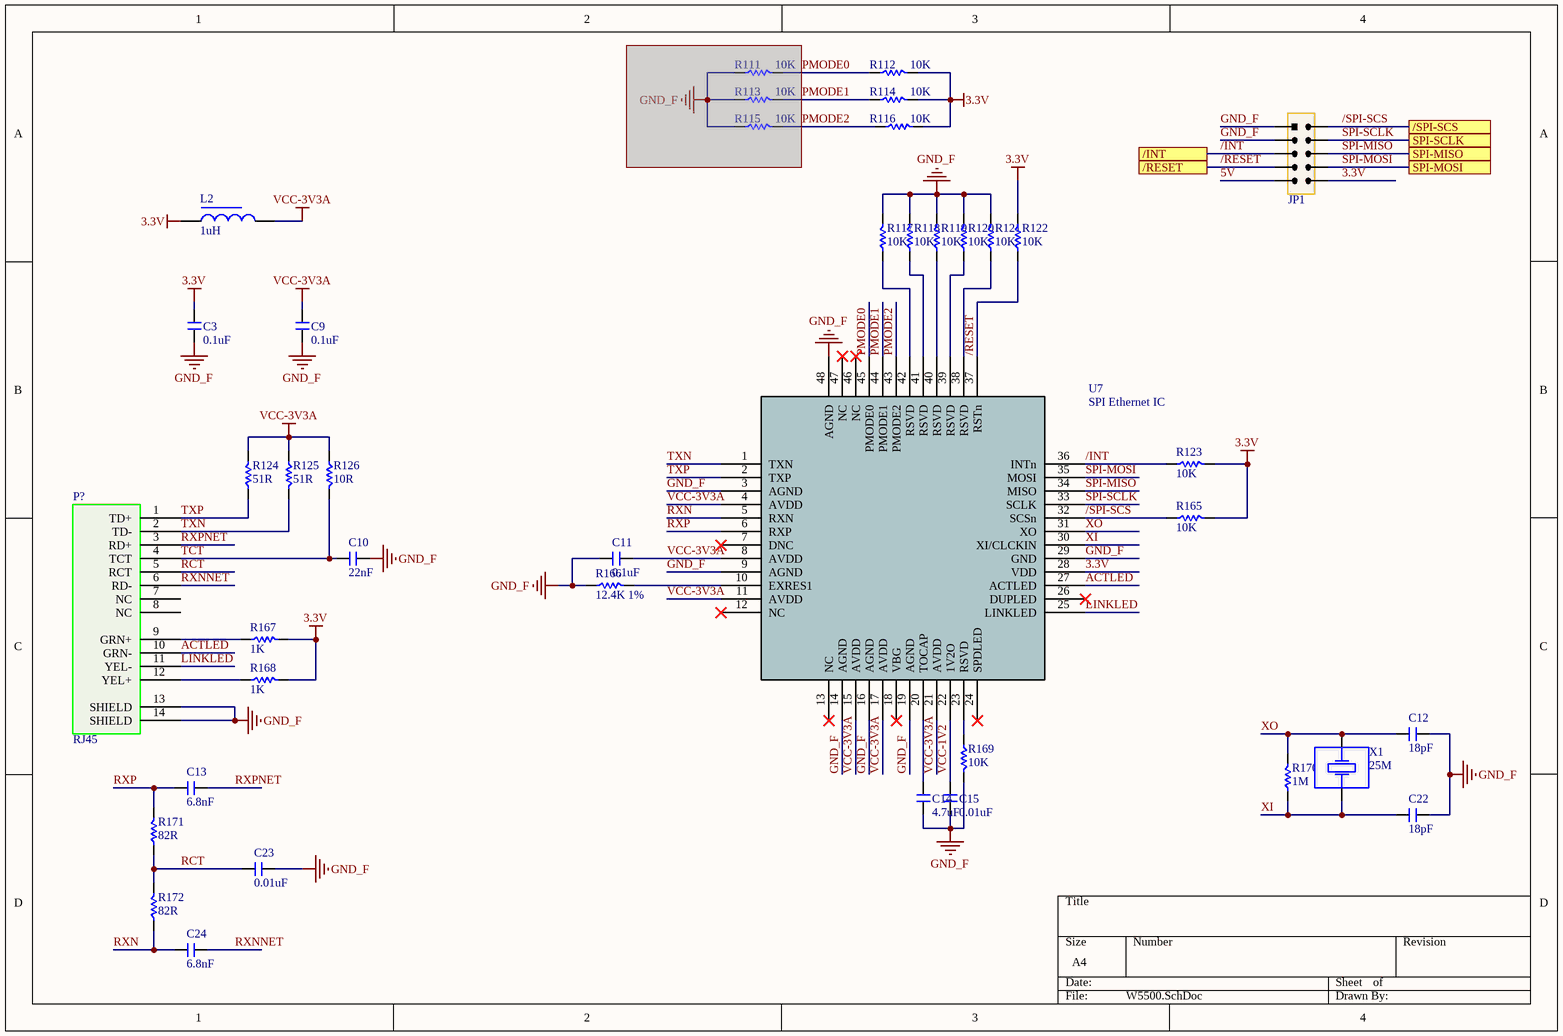
[diagram p5: W5500.SchDoc]

### Parts
(Parts that share a designator on the sheet are numbered #1, #2 ... from top to bottom, then left to right.)
C3#2  0.1uF  [C 0805]
C9#2  0.1uF  [C 0805]
C10#2  22nF  [C 0805]
C11  0.1uF  [C 0805]
C12  18pF  [C 0805]
C13  6.8nF  [C 0805]
C14  4.7uF  [C 0805]
C15  0.01uF  [C 0805]
C22  18pF  [C 0805]
C23  0.01uF  [C 0805]
C24  6.8nF  [C 0805]
JP1  Header 5X2  [HDR-5X2]  (value not drawn)
L2  1uH  [L 0805]
P?  RJ45  [RJ-45A12]
R111#2  10K  [R 0805]  (masked out: inside a compile mask, not in the netlist)
R112  10K  [R 0805]
R113  10K  [R 0805]  (masked out: inside a compile mask, not in the netlist)
R114  10K  [R 0805]
R115  10K  [R 0805]  (masked out: inside a compile mask, not in the netlist)
R116  10K  [R 0805]
R117  10K  [R 0805]
R118  10K  [R 0805]
R119  10K  [R 0805]
R120  10K  [R 0805]
R121  10K  [R 0805]
R122  10K  [R 0805]
R123  10K  [R 0805]
R124  51R  [R 0805]
R125  51R  [R 0805]
R126  10R  [R 0805]
R165  10K  [R 0805]
R166  12.4K 1%  [R 0805]
R167  1K  [R 0805]
R168  1K  [R 0805]
R169  10K  [R 0805]
R170  1M  [R 0805]
R171  82R  [R 0805]
R172  82R  [R 0805]
U7#2  SPI Ethernet IC  [LQFP48 7X7_L]
X1  25M  [XTAL-HC49S-THD]

### Ports
/INT, /RESET, /SPI-SCS, SPI-MISO, SPI-MOSI, SPI-SCLK

### Nets
3.3V: C3#2.2 JP1.10 L2.1 R112.2 R114.2 R116.2 R122.2 R123.2 R165.2 R167.2 R168.2 U7#2.28(VDD)
GND_F: C3#2.1 C9#2.1 C10#2.2 C11.1 C12.2 C14.2 C15.2 C22.2 C23.2 JP1.1 JP1.3 P?.13(SHIELD) P?.14(SHIELD) R117.2 R118.2 R119.2 R120.2 R121.2 R166.1 R169.2 U7#2.3(AGND) U7#2.9(AGND) U7#2.14(AGND) U7#2.16(AGND) U7#2.19(AGND) U7#2.29(GND) U7#2.48(AGND)
VCC-3V3A: C9#2.2 C11.2 L2.2 R124.2 R125.1 R126.1 U7#2.4(AVDD) U7#2.8(AVDD) U7#2.11(AVDD) U7#2.15(AVDD) U7#2.17(AVDD) U7#2.21(AVDD)
5V: JP1.9
/INT: JP1.5 R123.1 U7#2.36(INTn) ; port /INT
/RESET: JP1.7 R122.1 U7#2.37(RSTn) ; port /RESET
/SPI-SCS: JP1.2 R165.1 U7#2.32(SCSn) ; port /SPI-SCS
ACTLED: P?.10(GRN-) U7#2.27(ACTLED)
LINKLED: P?.11(YEL-) U7#2.25(LINKLED)
PMODE0: U7#2.45(PMODE0)
PMODE1: U7#2.44(PMODE1)
PMODE2: U7#2.43(PMODE2)
RCT: C23.1 P?.5(RCT) R171.1 R172.2
RXN: C24.1 R172.1 U7#2.5(RXN)
RXNNET: C24.2 P?.6(RD-)
RXP: C13.1 R171.2 U7#2.6(RXP)
RXPNET: C13.2 P?.3(RD+)
SPI-MISO: JP1.6 U7#2.34(MISO) ; port SPI-MISO  [project net ETH_MISO]
SPI-MOSI: JP1.8 U7#2.35(MOSI) ; port SPI-MOSI  [project net ETH_MOSI]
SPI-SCLK: JP1.4 U7#2.33(SCLK) ; port SPI-SCLK  [project net ETH_CLK]
TCT: C10#2.1 P?.4(TCT) R126.2
TXN: P?.2(TD-) R125.2 U7#2.1(TXN)
TXP: P?.1(TD+) R124.1 U7#2.2(TXP)
VCC-1V2: C15.1 U7#2.22(1V2O)
XI: C22.1 R170.1 U7#2.30(XI/CLCKIN) X1.1
XO: C12.1 R170.2 U7#2.31(XO) X1.2
NetC14_1: C14.1 U7#2.20(TOCAP)
NetP?_9: P?.9(GRN+) R167.1
NetP?_12: P?.12(YEL+) R168.1
NetR117_1: R117.1 U7#2.42(RSVD)
NetR118_1: R118.1 U7#2.41(RSVD)
NetR119_1: R119.1 U7#2.40(RSVD)
NetR120_1: R120.1 U7#2.39(RSVD)
NetR121_1: R121.1 U7#2.38(RSVD)
NetR166_2: R166.2 U7#2.10(EXRES1)
NetR169_1: R169.1 U7#2.23(RSVD)

Not connected (* = marked no-connect by the designer): P? 7(NC) 8(NC); R112 1; R114 1; R116 1; U7#2 7(DNC)* 12(NC)* 13(NC)* 18(VBG)* 24(SPDLED)* 26(DUPLED)* 46(NC)* 47(NC)*

### Library data of the parts
C3#2 C9#2 C10#2 C11-C15 C22-C24 = C: as C8#1 on sheet ESP32; 学习资源: www.ooocke.com
JP1 = Header 5X2: 5*2P Connector; BOM名称: 5*2P接插件; 版权归属: 源创客; 学习资源: www.ooocke.com
L2 = L: Low power chip inductor; BOM名称: 小功率贴片电感; 版权归属: 源创客; 学习资源: www.ooocke.com
P? = RJ45 LED
R111#2 R112-R126 R165-R172 = R: Chip resistor; 版权归属: 源创客; BOM名称: Chip resistor; 学习资源: www.ooocke.com
U7#2 = W5500
X1 = XTAL-2: 2-Pin crystal; BOM名称: 2脚晶振; 版权归属: 源创客; 学习资源: www.ooocke.com

## Nets that join several sheets
3.3V: Main (9 pins), ESP32 (6 pins), Power Regulator (8 pins), Digital Output (15 pins), Digital Input (21 pins), W5500 (12 pins)
24V: Power Regulator (6 pins), Digital Output (32 pins), Digital Input (8 pins)
GND: Power Regulator (8 pins), Digital Output (24 pins), Digital Input (16 pins)
GND_F: Main (8 pins), ESP32 (8 pins), Power Regulator (17 pins), Digital Output (14 pins), Digital Input (12 pins), W5500 (27 pins)
/INT: ESP32 (U6.37), W5500 (JP1.5 R123.1 U7#2.36)
/RESET: ESP32 (U6.26), W5500 (JP1.7 R122.1 U7#2.37)
/SPI-SCS: ESP32 (U6.23), W5500 (JP1.2 R165.1 U7#2.32)
ETH_CLK: ESP32 (U6.13), W5500 (JP1.4 U7#2.33)
ETH_MISO: ESP32 (U6.14), W5500 (JP1.6 U7#2.34)
ETH_MOSI: ESP32 (U6.16), W5500 (JP1.8 U7#2.35)
InputeINT: ESP32 (U6.7), Digital Input (U3.8)
mcpINT: Main (U1.8), ESP32 (U6.8)
OutputINT: ESP32 (U6.6), Digital Output (U4.8)
SCL: Main (U1.1), ESP32 (U6.36), Digital Output (C5.2 R67.2 U4.1), Digital Input (U3.1)
SDA: Main (U1.2), ESP32 (U6.33), Digital Output (C4#1.2 R66.2 U4.2), Digital Input (U3.2)